# EAGLE design TEMT600-v1.0 (EAGLE 5.06)
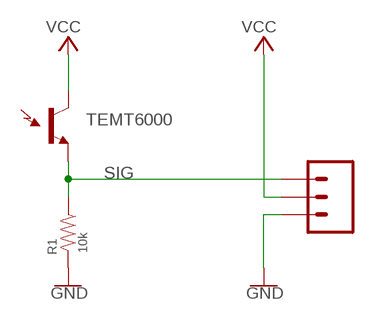
[diagram p0: schematic, sheet 1]

## Parts
J1  M03  [M03]
R1  10k  RES-0603  [0603-RES]
U$1  TEMT6000  [TEMT6000]

## Nets
GND: J1.3 R1.2
SIG: J1.1 R1.1 U$1.EMITTER(E1)
VCC: J1.2 U$1.COLLECTOR(C1)

## Library data of the parts
J1 = Travis:M03
R1 = Travis:RES-0603
U$1 = Travis:TEMT6000

## Board
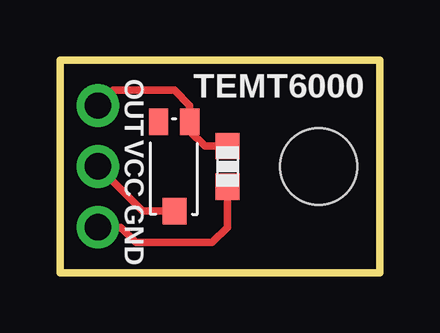
[diagram p1: board, top side]
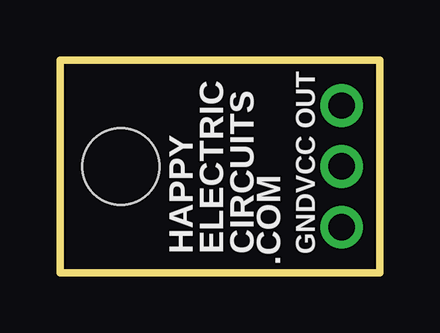
[diagram p2: board, bottom side, seen from below]

Size 13.34 x 8.89 mm. Coordinates in mm from the lower left corner, seen from the top.
Outline: 0,0 13.34,0 13.34,8.89 0,8.89 0,0
Copper layers (1*16): Top 0.035mm / dielectric 1.5mm / Bottom 0.035mm
Design rules "Sparkfun": minimum track width 8mil, minimum drill 20mil, track to track 8mil, track to pad 8mil, pad to pad 8mil, via to via 8mil, smd to smd 8mil, copper to edge 10mil, drill to drill 8mil, minimum pad ring 12mil, minimum via ring 10mil, stop-mask expansion 4mil, vias tented up to drill 25mil, thermal gap 10mil
Holes 3.2 mm at 10.79,4.45

### Footprints (pad centres in the part's own frame; a part is rotated, then mirrored left to right if it is on the bottom)
M03 = drill 1.1 pad 1.778 round: 1 0,0; 2 0,-2.54; 3 0,-5.08
0603-RES = smd 1.1 x 1: 1 -0.85,0; 2 0.85,0
TEMT6000 = smd 1.1 x 0.8: BASE -1.87,-0.65; EMITTER -1.87,0.65 | smd 1.1 x 1: COLLECTOR 1.86,0.01

### Placement (x,y rotation side)
J1  1.59,6.99 0 top
R1  6.99,4.45 270 top
U$1  4.76,4.45 270 top

### Tracks (layer width: path | path; a pad name or v marks a point on that pad's centre or on a via)
GND
  Top 0.305: R1.2 6.99,1.91 6.35,1.27 3.17,1.27 2.54,1.91 J1.3
SIG
  Top 0.305: J1.1 2.22,7.62 4.78,7.62 5.41,6.99 U$1.EMITTER 5.41,5.93 6.05,5.29 R1.1
VCC
  Top 0.305: J1.2 3.45,2.58 U$1.COLLECTOR

### Text on the board
tPlace: OUT | TEMT6000 | VCC | GND
bPlace: OUT | VCC | GND | CIRCUITS | ELECTRIC | HAPPY | .COM